# Altium schematic sheet LANA_TNY_00.SchDoc: Lana TNY
size A3; Date: 27/06/2023; DrawnBy: Wim Van Gool; DocumentNumber: 1; Revision: 00; SheetNumber: 1; SheetTotal: 1
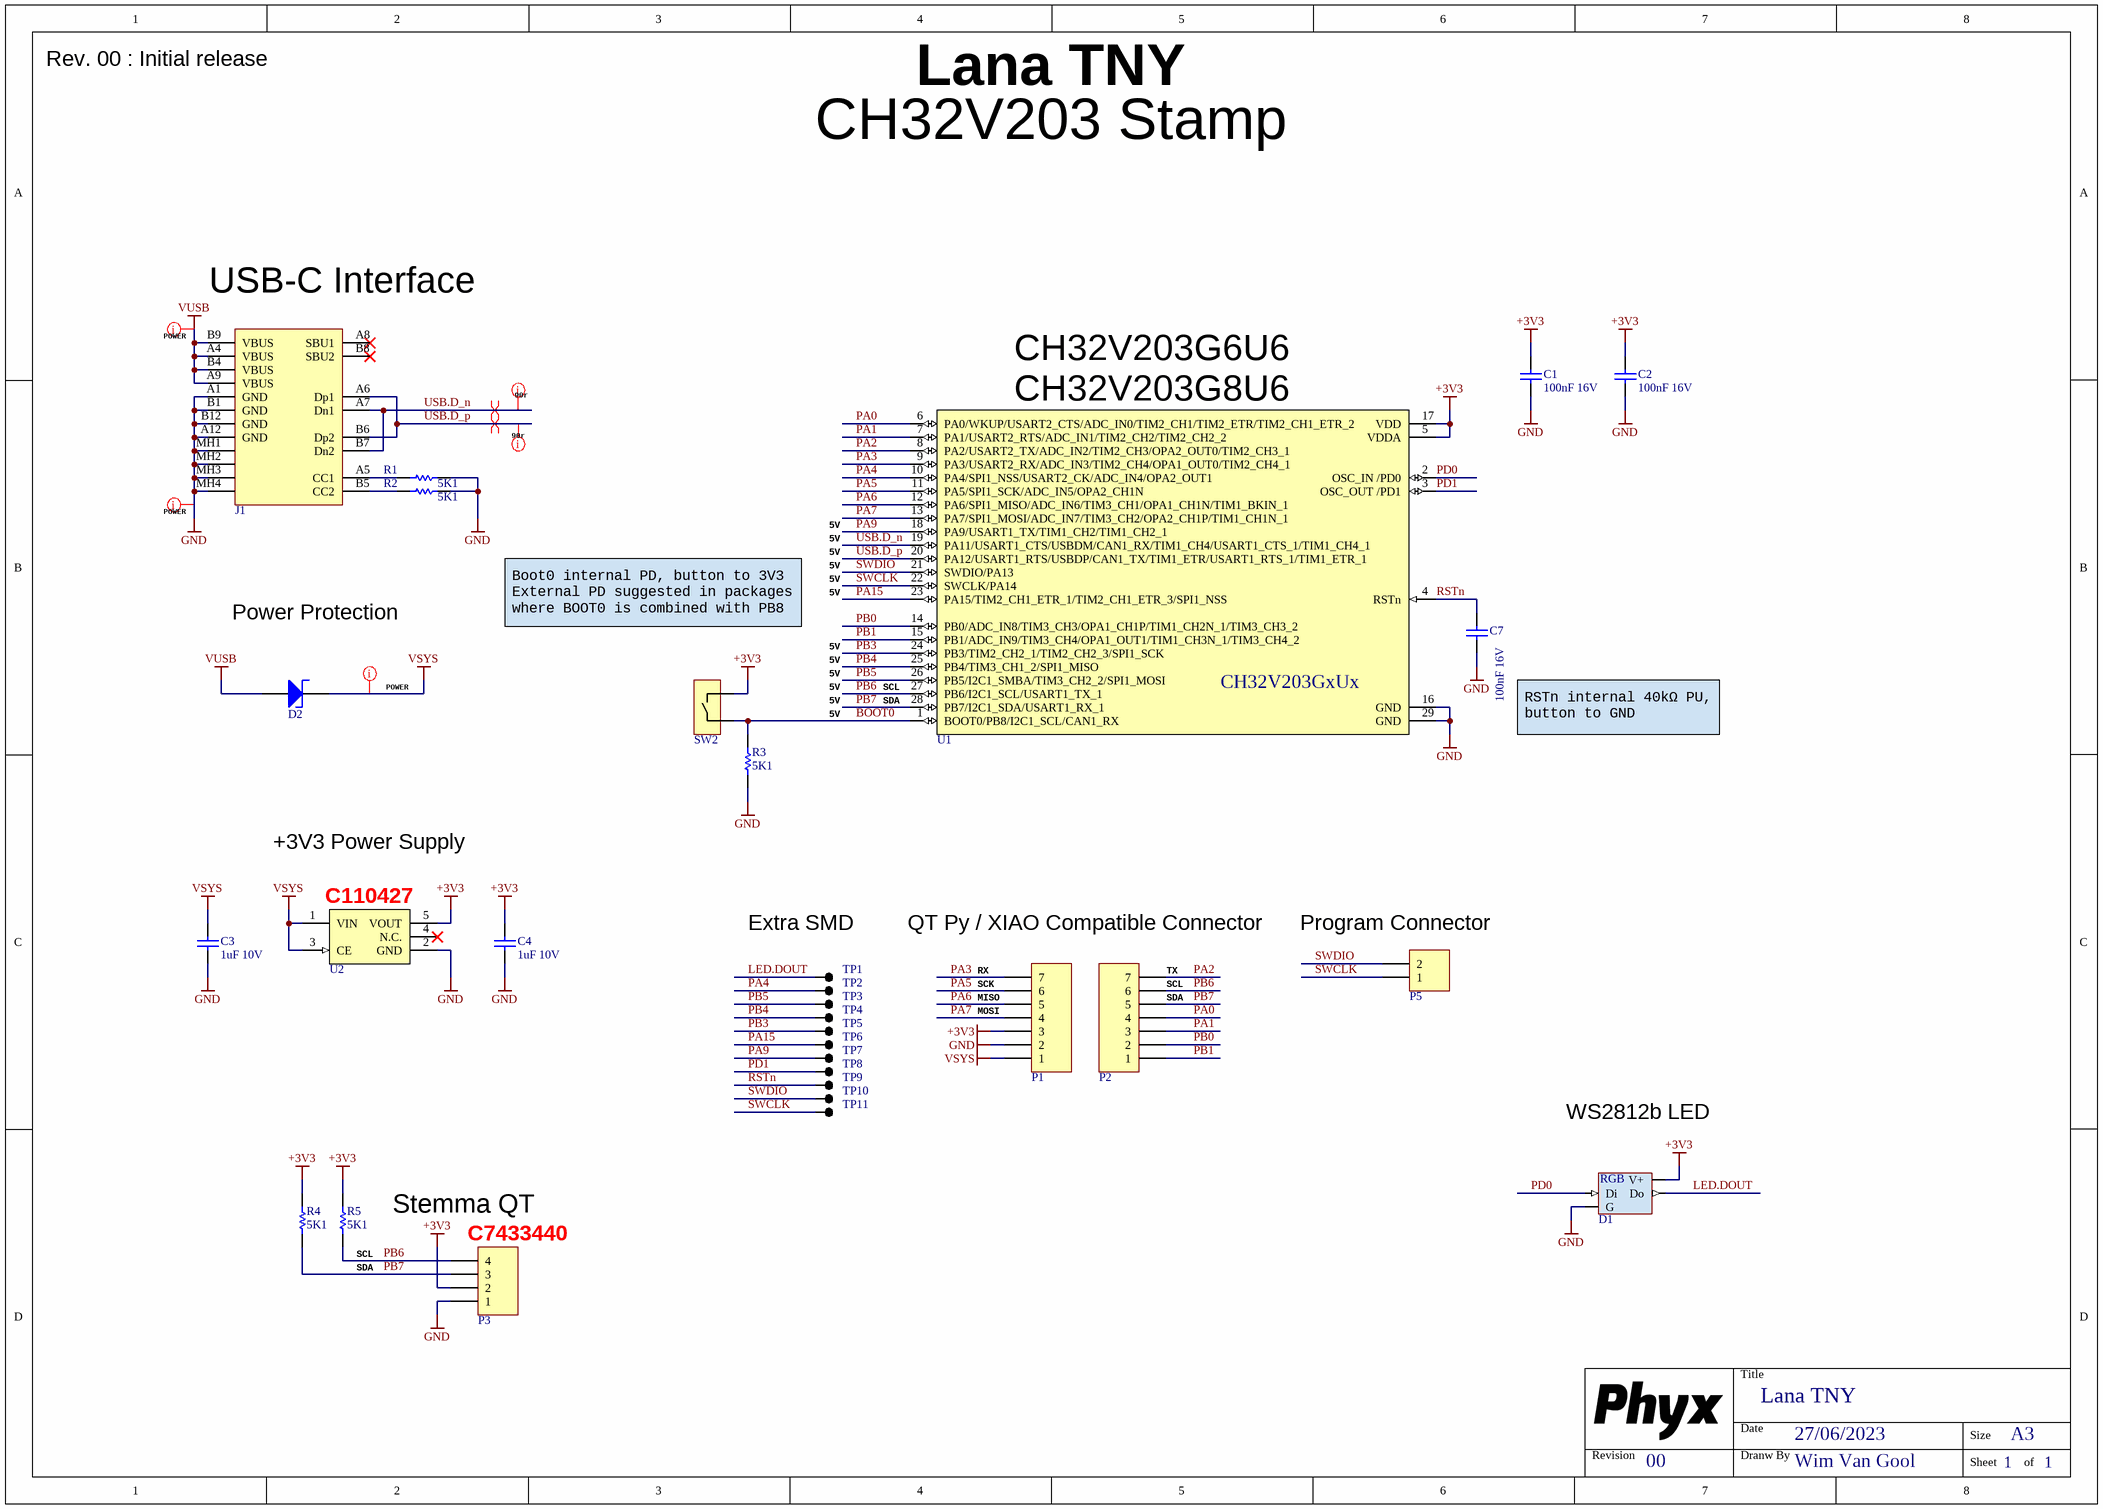
[diagram p0: LANA_TNY_00.SchDoc]

## Parts
C1  value 100nF 16V  [C0402]  (hidden comment: CAP_CERAMIC)
C2  value 100nF 16V  [C0402]  (hidden comment: CAP_CERAMIC)
C3  value 1uF 10V  [C0402]  (hidden comment: CAP_CERAMIC)
C4  value 1uF 10V  [C0402]  (hidden comment: CAP_CERAMIC)
C7  value 100nF 16V  [C0402]  (hidden comment: CAP_CERAMIC)
D1  WS2812 based digital RGB LED 1010 package  [LED_1010_WS2812B]  (value not drawn)
D2  CUS10S30 Schottky Power Rectifier, 1A, 30V  [SOD-323_AC]  (value not drawn)
J1  USB 2.0 C Reversible Receptacle Horizontal full SMD  [XUNPU-TYPEC-304S-ACP16]  (value not drawn)
P1  Header 7  [HDR1X7]  (value not drawn)
P2  Header 7  [HDR1X7]  (value not drawn)
P3  Header 1.0mm Shrouded 4  [WE_665304124022]  (value not drawn)
P5  Header 2  [HDR1X2]  (value not drawn)
R1  value 5K1  [R0402]  (hidden comment: RESISTOR)
R2  value 5K1  [R0402]  (hidden comment: RESISTOR)
R3  value 5K1  [R0402]  (hidden comment: RESISTOR)
R4  value 5K1  [R0402]  (hidden comment: RESISTOR)
R5  value 5K1  [R0402]  (hidden comment: RESISTOR)
SW2  TS24CA RA Tactile Switch 12V 50mA  [SHOU_HAN_TS24CA]  (value not drawn)
TP1  TEST_PAD  [TP_0.4mm]  (value not drawn)
TP2  TEST_PAD  [TP_0.4mm]  (value not drawn)
TP3  TEST_PAD  [TP_0.4mm]  (value not drawn)
TP4  TEST_PAD  [TP_0.4mm]  (value not drawn)
TP5  TEST_PAD  [TP_0.4mm]  (value not drawn)
TP6  TEST_PAD  [TP_0.4mm]  (value not drawn)
TP7  TEST_PAD  [TP_0.4mm]  (value not drawn)
TP8  TEST_PAD  [TP_0.4mm]  (value not drawn)
TP9  TEST_PAD  [TP_0.4mm]  (value not drawn)
TP10  TEST_PAD  [TP_0.4mm]  (value not drawn)
TP11  TEST_PAD  [TP_0.4mm]  (value not drawn)
U1  WCH CH32V203G8U6 QFN28 RISC-V 32-bit MCU, 64KB Flash, 20KB RAM, USB, CAN  [QFN_28_4.0x4.0_P0.4]  (value not drawn)
U2  3V3 LDO 300mA 150mV  [SOT23-5]  (value not drawn)

## Nets
+3V3: C1.1 C2.1 C4.1 D1.2(V+) P1.3 P3.2 R4.1 R5.1 SW2.1 U1.5(VDDA) U1.17(VDD) U2.5(VOUT)
GND: C1.2 C2.2 C3.2 C4.2 C7.2 D1.3(G) J1.A1(GND) J1.A12(GND) J1.B1(GND) J1.B12(GND) J1.MH1(Tab) J1.MH2(Tab) J1.MH3(Tab) J1.MH4(Tab) P1.2 P3.1 R1.1 R2.1 R3.2 U1.16(GND) U1.29(GND) U2.2(GND)
VSYS: C3.1 D2.C P1.1 U2.1(VIN) U2.3(CE)
VUSB: D2.A J1.A4(VBUS) J1.A9(VBUS) J1.B4(VBUS) J1.B9(VBUS)
BOOT0: R3.1 SW2.2 U1.1(BOOT0/PB8/I2C1_SCL/CAN1_RX)
LED.DOUT: D1.1(Do) TP1.1
PA0: P2.4 U1.6(PA0/WKUP/USART2_CTS/ADC_IN0/TIM2_CH1/TIM2_ETR/TIM2_CH1_ETR_2)
PA1: P2.3 U1.7(PA1/USART2_RTS/ADC_IN1/TIM2_CH2/TIM2_CH2_2)
PA2: P2.7 U1.8(PA2/USART2_TX/ADC_IN2/TIM2_CH3/OPA2_OUT0/TIM2_CH3_1)
PA3: P1.7 U1.9(PA3/USART2_RX/ADC_IN3/TIM2_CH4/OPA1_OUT0/TIM2_CH4_1)
PA4: TP2.1 U1.10(PA4/SPI1_NSS/USART2_CK/ADC_IN4/OPA2_OUT1)
PA5: P1.6 U1.11(PA5/SPI1_SCK/ADC_IN5/OPA2_CH1N)
PA6: P1.5 U1.12(PA6/SPI1_MISO/ADC_IN6/TIM3_CH1/OPA1_CH1N/TIM1_BKIN_1)
PA7: P1.4 U1.13(PA7/SPI1_MOSI/ADC_IN7/TIM3_CH2/OPA2_CH1P/TIM1_CH1N_1)
PA9: TP7.1 U1.18(PA9/USART1_TX/TIM1_CH2/TIM1_CH2_1)
PA15: TP6.1 U1.23(PA15/TIM2_CH1_ETR_1/TIM2_CH1_ETR_3/SPI1_NSS)
PB0: P2.2 U1.14(PB0/ADC_IN8/TIM3_CH3/OPA1_CH1P/TIM1_CH2N_1/TIM3_CH3_2)
PB1: P2.1 U1.15(PB1/ADC_IN9/TIM3_CH4/OPA1_OUT1/TIM1_CH3N_1/TIM3_CH4_2)
PB3: TP5.1 U1.24(PB3/TIM2_CH2_1/TIM2_CH2_3/SPI1_SCK)
PB4: TP4.1 U1.25(PB4/TIM3_CH1_2/SPI1_MISO)
PB5: TP3.1 U1.26(PB5/I2C1_SMBA/TIM3_CH2_2/SPI1_MOSI)
PB6: P2.6 P3.4 R5.2 U1.27(PB6/I2C1_SCL/USART1_TX_1)
PB7: P2.5 P3.3 R4.2 U1.28(PB7/I2C1_SDA/USART1_RX_1)
PD0: D1.4(Di) U1.2(OSC_IN_/PD0)
PD1: TP8.1 U1.3(OSC_OUT_/PD1)
RSTn: C7.1 TP9.1 U1.4(RSTn)
SWCLK: P5.1 TP11.1 U1.22(SWCLK/PA14)
SWDIO: P5.2 TP10.1 U1.21(SWDIO/PA13)
USB.D_n: J1.A7(Dn1) J1.B7(Dn2) U1.19(PA11/USART1_CTS/USBDM/CAN1_RX/TIM1_CH4/USART1_CTS_1/TIM1_CH4_1)
USB.D_p: J1.A6(Dp1) J1.B6(Dp2) U1.20(PA12/USART1_RTS/USBDP/CAN1_TX/TIM1_ETR/USART1_RTS_1/TIM1_ETR_1)
NetJ1_A5: J1.A5(CC1) R1.2
NetJ1_B5: J1.B5(CC2) R2.2

Not connected (* = marked no-connect by the designer): J1 A8(SBU1)* B8(SBU2)*; U2 4(N.C.)*

## Layout directives
net class 90r: USB.D_n, USB.D_p
differential pair: USB.D_n, USB.D_p
net class POWER: GND, VSYS, VUSB

## Notes on the sheet
- Rev. 00 : Initial release
- CH32V203 Stamp
- (near J1) USB-C Interface
- CH32V203G6U6
- (near U1) CH32V203G8U6
- 5V
- Power Protection
- Boot0 internal PD, button to 3V3
  External PD suggested in packages where BOOT0 is combined with PB8
- (near U1) SCL
- (near U1) SDA
- RSTn internal 40kΩ PU, button to GND
- +3V3 Power Supply
- (near U2) C110427
- Extra SMD
- (near P1) SCK
- (near P1) RX
- QT Py / XIAO Compatible Connector
- (near P2) TX
- (near P2) SCL
- (near P5) Program Connector
- (near P1) MOSI
- (near P1) MISO
- (near P2) SDA
- WS2812b LED
- (near R5) SCL
- Stemma QT
- (near P3) C7433440
- (near R5) SDA
- Title
- Revision
- Date
- Dranw By
- Size
- A3
- Sheet
- of
- (in symbol LED # RGB XL-1010RGBC-WS2812B) RGB
- (in symbol RISCV # CH32V203G8U6) CH32V203GxUx

## Library data of the parts
C1 C2 C7 = CAP # 100nF 16V 0402: Capacitor Ceramic; Supplier 1: Farnell; Supplier Part Number 1: 1758896; Supplier 3: Generic; Supplier Part Number 3: 100nF 16V 0402 X7R
C3 C4 = CAP # 1uF 10V 0402: Capacitor Ceramic; Supplier 1: LCSC; Supplier Part Number 1: C380293; Supplier 3: Generic; Supplier Part Number 3: 1uF 10V 0402 X5R
D1 = LED # RGB XL-1010RGBC-WS2812B: =Description; Value: XL-1010RGBC-WS2812B; Supplier 1: LCSC; Supplier Part Number 1: C5349953
D2 = Schottky # CUS10S30: =Description; Value: CUS10S30,H3F; Supplier 1: LCSC; Supplier Part Number 1: C146335
J1 = USB # C 2.0 RCPT TYPEC-304S-ACP16: Value: TYPEC-304S-ACP16; Supplier 1: LCSC; Supplier Part Number 1: C720630
P1 P2 = Pin Header 2.54mm 7way
P3 = HDR # SHR 1.0mm 4way - 665304124022: Value: 665304124022; Supplier 1: Wurth; Supplier Part Number 1: 665304124022; Supplier 2: Mouser; Supplier Part Number 2: 710-665304124022
P5 = Pin Header 2.54mm 2way: Supplier 1: LCSC; Supplier Part Number 1: C492401; Supplier 2: LCSC; Supplier Part Number 2: C541856
R1-R5 = RES # 5K1 0402: Supplier 1: LCSC; Supplier Part Number 1: C274895; Supplier 3: Generic; Supplier Part Number 3: 5K1 1% 0402
SW2 = SW # TACT RA TS24CA: Value: TS24CA; Supplier 1: LCSC; Supplier Part Number 1: C393942
TP1-TP11 = TP # 0.4mm: Value: NO BOM; Supplier 1: XXX; Supplier Part Number 1: FOOTPRINT ONLY
U1 = RISCV # CH32V203G8U6: Value: CH32V203G8U6; Supplier 1: LCSC; Supplier Part Number 1: C5187530
U2 = LDO # 3V3 300mA RT9078-33GJ5: =Designator; Value: RT9078-33GJ5; Supplier 1: LCSC; Supplier Part Number 1: C110427